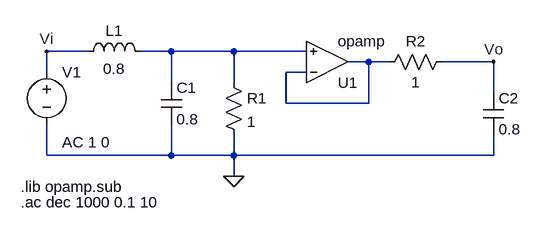
[diagram p0: schematic TS3.asc]
TS3.asc, the LTspice schematic file:
Version 4
SHEET 1 880 680
WIRE 80 112 16 112
WIRE 208 112 160 112
WIRE 304 112 208 112
WIRE 416 112 304 112
WIRE 512 128 480 128
WIRE 544 128 512 128
WIRE 704 128 624 128
WIRE 16 144 16 112
WIRE 416 144 384 144
WIRE 208 160 208 112
WIRE 304 160 304 112
WIRE 704 176 704 128
WIRE 384 192 384 144
WIRE 512 192 512 128
WIRE 512 192 384 192
WIRE 16 272 16 224
WIRE 208 272 208 224
WIRE 208 272 16 272
WIRE 304 272 304 240
WIRE 304 272 208 272
WIRE 704 272 704 240
WIRE 704 272 304 272
WIRE 304 304 304 272
FLAG 304 304 0
FLAG 704 128 Vo
FLAG 16 112 Vi
SYMBOL ind 64 128 R270
WINDOW 0 32 56 VTop 2
WINDOW 3 5 56 VBottom 2
SYMATTR InstName L1
SYMATTR Value 0.8
SYMBOL cap 192 160 R0
SYMATTR InstName C1
SYMATTR Value 0.8
SYMBOL res 288 144 R0
SYMATTR InstName R1
SYMATTR Value 1
SYMBOL res 640 112 R90
WINDOW 0 0 56 VBottom 2
WINDOW 3 32 56 VTop 2
SYMATTR InstName R2
SYMATTR Value 1
SYMBOL cap 688 176 R0
SYMATTR InstName C2
SYMATTR Value 0.8
SYMBOL OpAmps\\opamp 448 192 M180
SYMATTR InstName U1
SYMBOL voltage 16 128 R0
WINDOW 123 24 124 Left 2
WINDOW 39 0 0 Left 0
SYMATTR Value2 AC 1 0
SYMATTR InstName V1
SYMATTR Value ""
TEXT -24 320 Left 2 !.lib opamp.sub
TEXT -24 344 Left 2 !.ac dec 1000 0.1 10

The netlist it stands for:
* TS3.asc
L1 Vi N001 0.8
C1 N001 0 0.8
R1 N001 0 1
R2 Vo N002 1
C2 Vo 0 0.8
XU1 N002 N001 N002 opamp Aol=100K GBW=10Meg  ; pins invin noninvin out
V1 Vi 0 AC 1 0
.lib opamp.sub
.ac dec 1000 0.1 10
.backanno
.end